# EAGLE design 2x2AND_OR_1 (EAGLE 6.5.0)

## Sheet 1 of 3
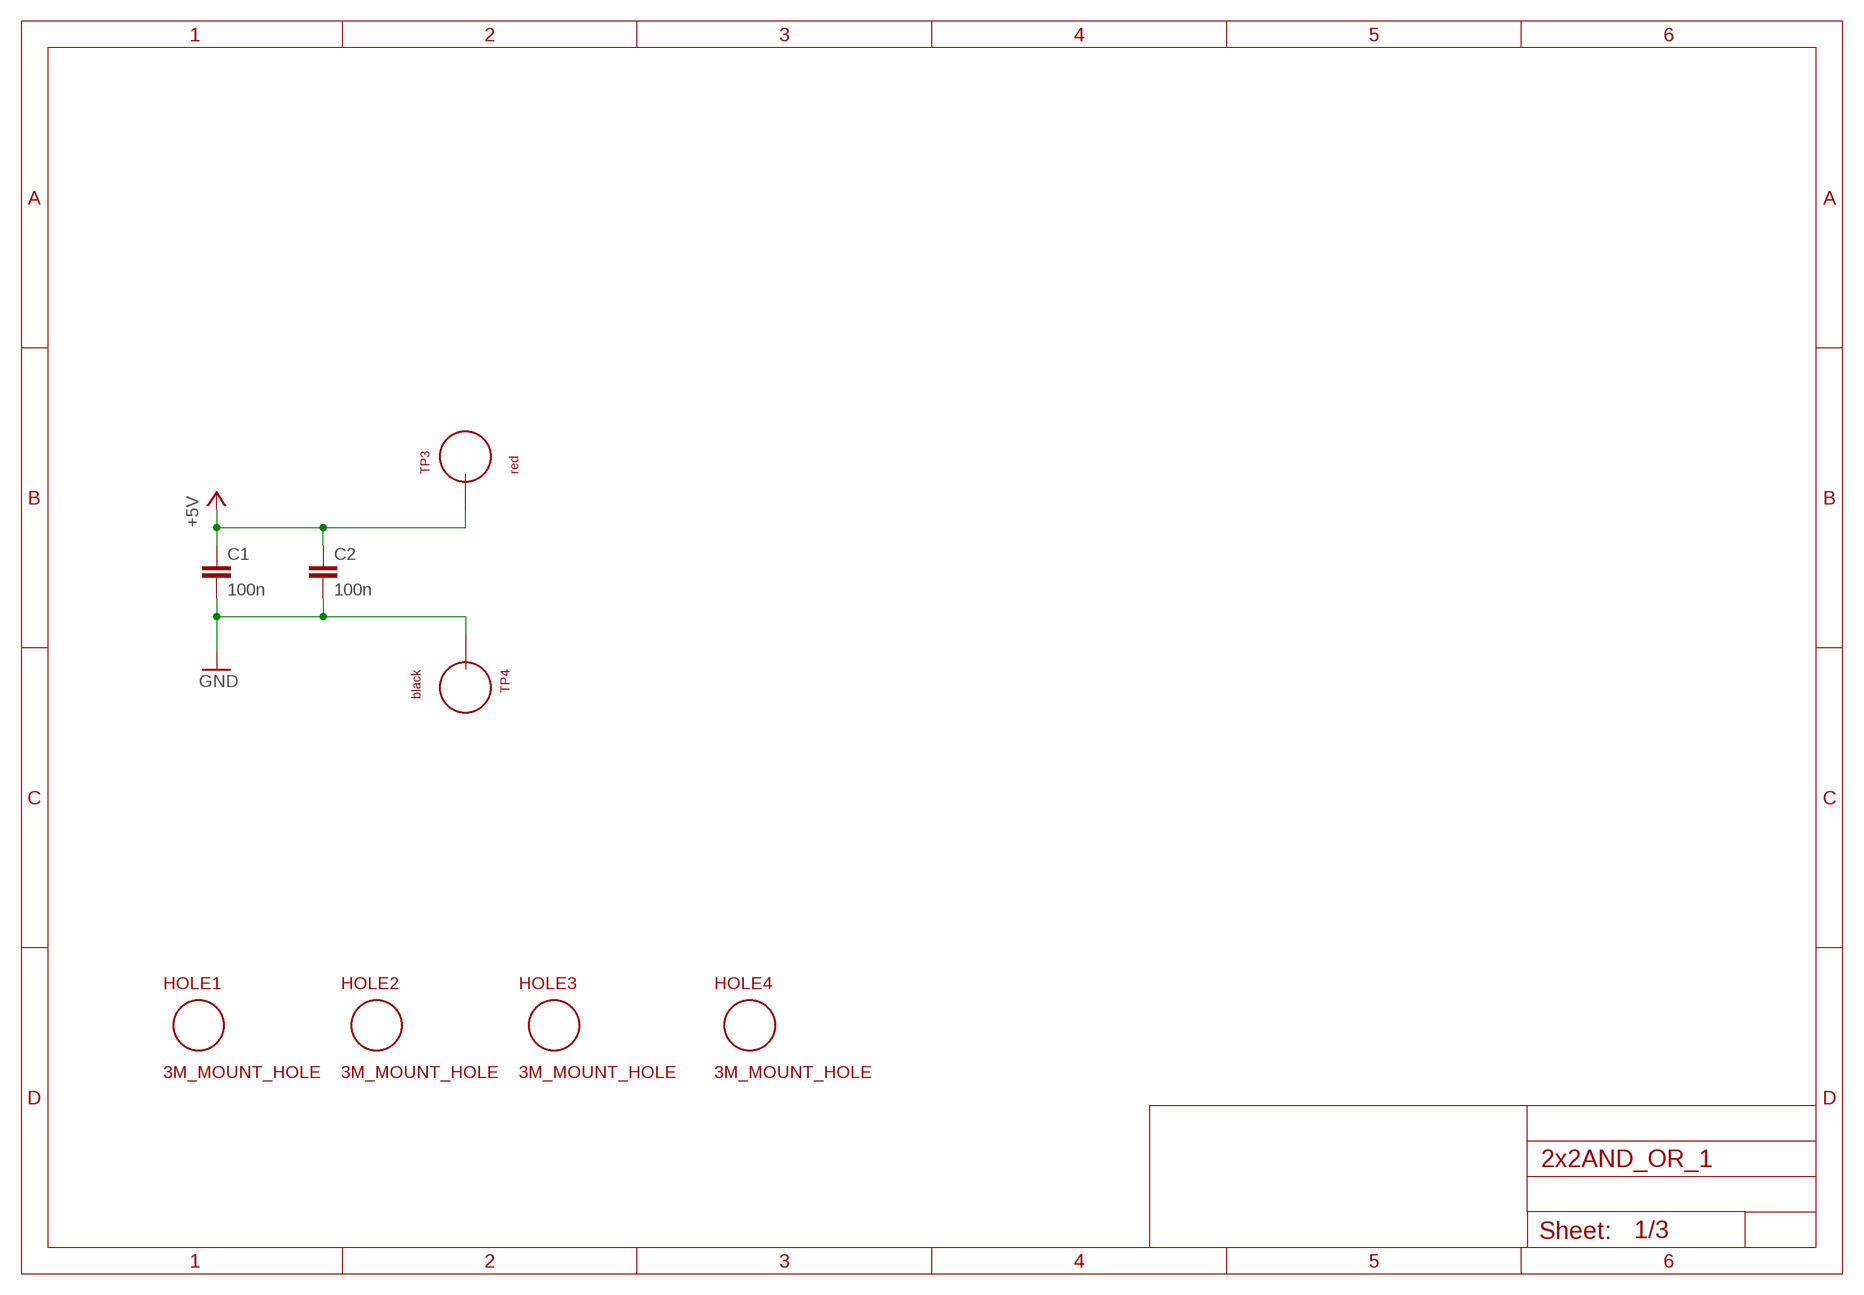
[diagram p0: schematic, sheet 1]

### Parts
C1  100n  C_P2INCH  [CAP_P2INCH]
C2  100n  C_P2INCH  [CAP_P2INCH]
HOLE1  3M_MOUNT_HOLE  [3M_HOLE]
HOLE2  3M_MOUNT_HOLE  [3M_HOLE]
HOLE3  3M_MOUNT_HOLE  [3M_HOLE]
HOLE4  3M_MOUNT_HOLE  [3M_HOLE]
TP3  red  TEST_LOOP  [TEST_LOOP]
TP4  black  TEST_LOOP  [TEST_LOOP]

### Nets
+5V: C1.1 C2.1 TP3.P$1 ; also sheet 2,3
GND: C1.2 C2.2 TP4.P$1 ; also sheet 2,3

## Sheet 2 of 3
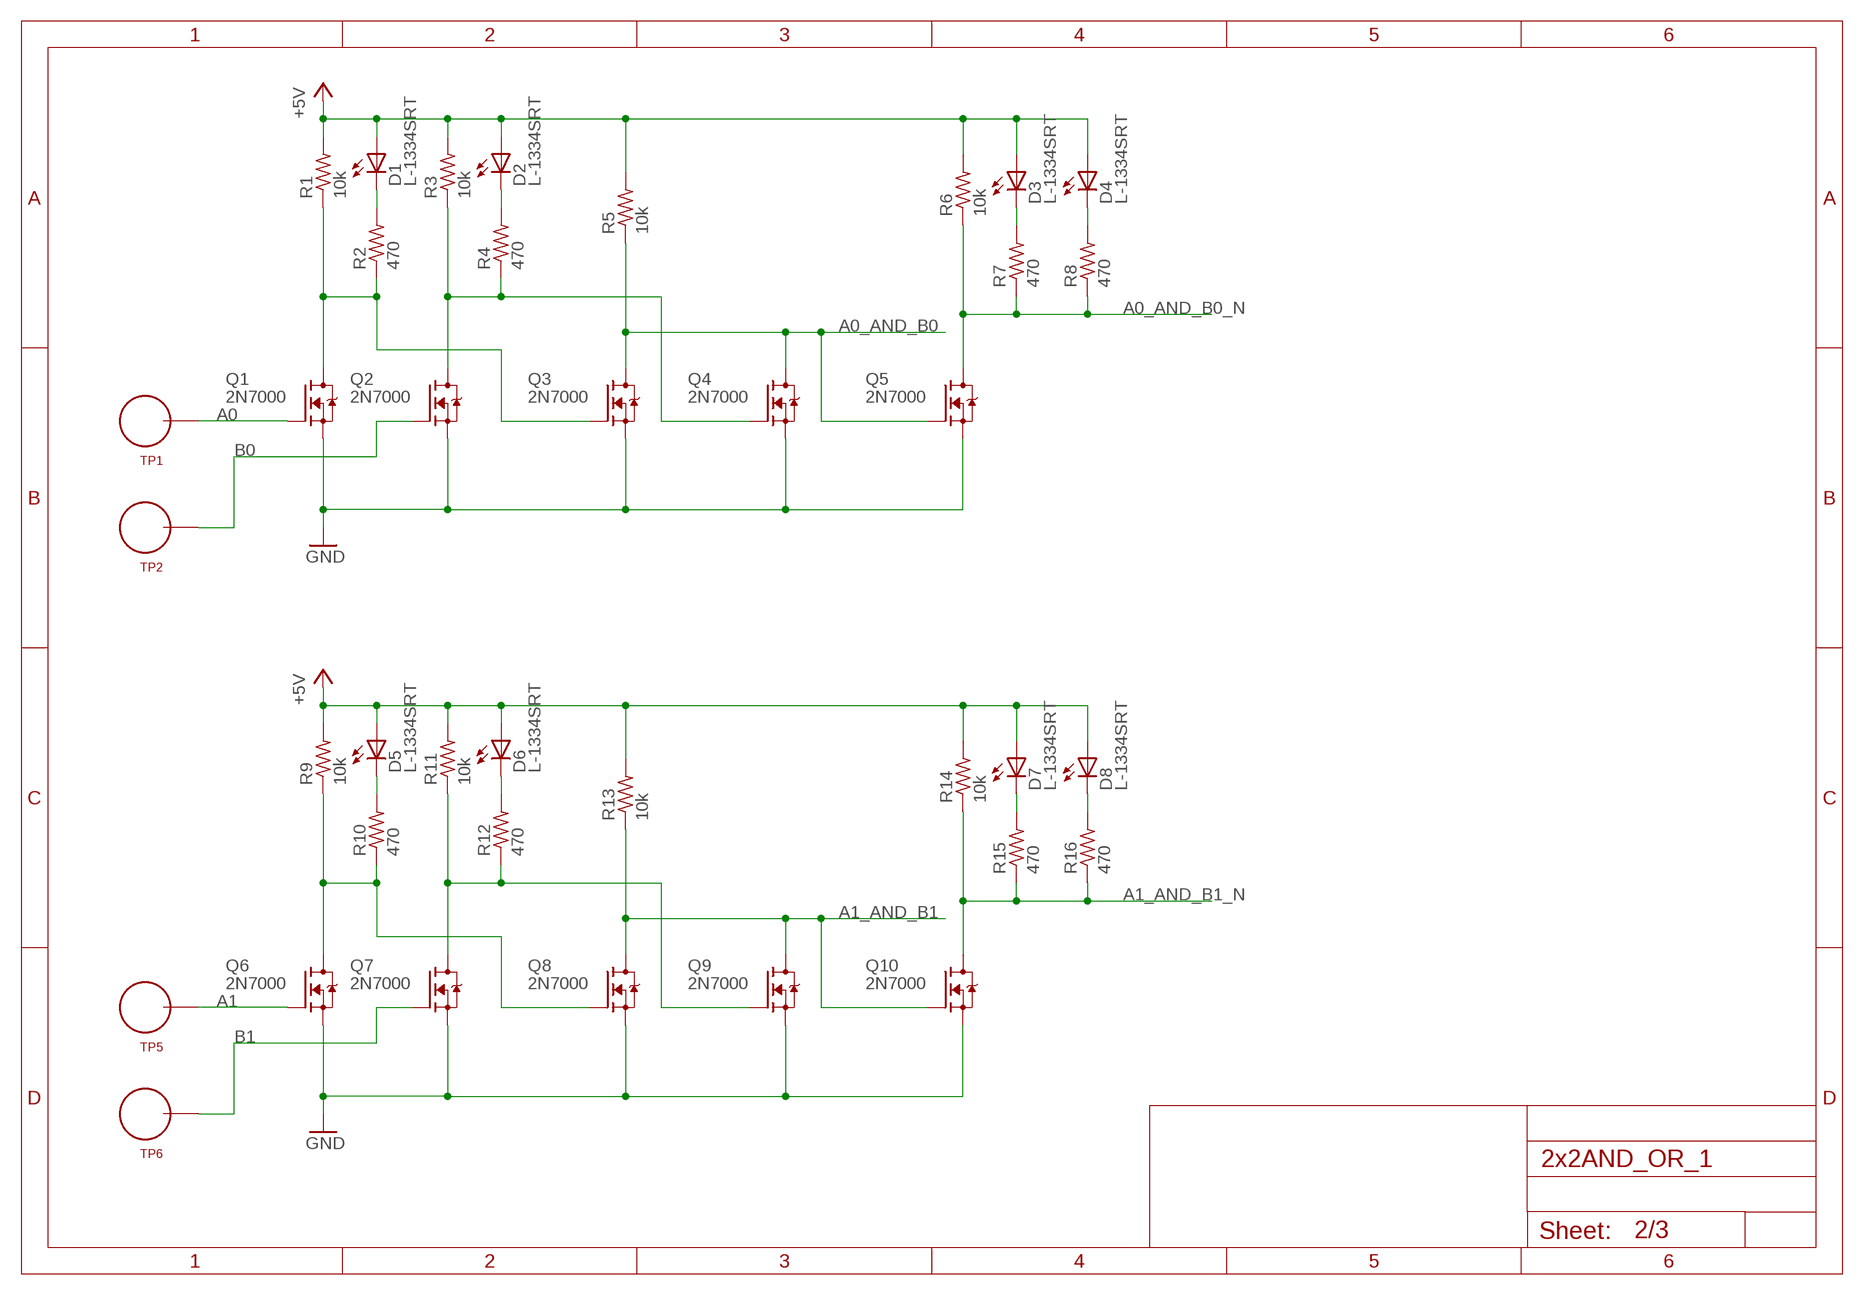
[diagram p1: schematic, sheet 2]

### Parts
D1  L-1334SRT  [LED3MM]
D2  L-1334SRT  [LED3MM]
D3  L-1334SRT  [LED3MM]
D4  L-1334SRT  [LED3MM]
D5  L-1334SRT  [LED3MM]
D6  L-1334SRT  [LED3MM]
D7  L-1334SRT  [LED3MM]
D8  L-1334SRT  [LED3MM]
Q1  2N7000  [TO92-DGS]
Q2  2N7000  [TO92-DGS]
Q3  2N7000  [TO92-DGS]
Q4  2N7000  [TO92-DGS]
Q5  2N7000  [TO92-DGS]
Q6  2N7000  [TO92-DGS]
Q7  2N7000  [TO92-DGS]
Q8  2N7000  [TO92-DGS]
Q9  2N7000  [TO92-DGS]
Q10  2N7000  [TO92-DGS]
R1  10k  R_P2INCH  [R_P2INCH]
R2  470  R_P2INCH  [R_P2INCH]
R3  10k  R_P2INCH  [R_P2INCH]
R4  470  R_P2INCH  [R_P2INCH]
R5  10k  R_P2INCH  [R_P2INCH]
R6  10k  R_P2INCH  [R_P2INCH]
R7  470  R_P2INCH  [R_P2INCH]
R8  470  R_P2INCH  [R_P2INCH]
R9  10k  R_P2INCH  [R_P2INCH]
R10  470  R_P2INCH  [R_P2INCH]
R11  10k  R_P2INCH  [R_P2INCH]
R12  470  R_P2INCH  [R_P2INCH]
R13  10k  R_P2INCH  [R_P2INCH]
R14  10k  R_P2INCH  [R_P2INCH]
R15  470  R_P2INCH  [R_P2INCH]
R16  470  R_P2INCH  [R_P2INCH]
TP1  TEST_LOOP  [TEST_LOOP]
TP2  TEST_LOOP  [TEST_LOOP]
TP5  TEST_LOOP  [TEST_LOOP]
TP6  TEST_LOOP  [TEST_LOOP]

### Nets
+5V: D1.A D2.A D3.A D4.A D5.A D6.A D7.A D8.A R1.2 R3.2 R5.2 R6.2 R9.2 R11.2 R13.2 R14.2 ; also sheet 1,3
A0: Q1.G TP1.P$1
A0_AND_B0: Q3.D Q4.D Q5.G R5.1 ; also sheet 3
A0_AND_B0_N: Q5.D R6.1 R7.1 R8.1
A1: Q6.G TP5.P$1
A1_AND_B1: Q8.D Q9.D Q10.G R13.1 ; also sheet 3
A1_AND_B1_N: Q10.D R14.1 R15.1 R16.1
B0: Q2.G TP2.P$1
B1: Q7.G TP6.P$1
GND: Q1.S Q2.S Q3.S Q4.S Q5.S Q6.S Q7.S Q8.S Q9.S Q10.S ; also sheet 1,3
N$1: D1.K(C) R2.2
N$2: Q1.D Q3.G R1.1 R2.1
N$3: D4.K(C) R8.2
N$4: D2.K(C) R4.2
N$5: Q2.D Q4.G R3.1 R4.1
N$6: D5.K(C) R10.2
N$7: Q6.D Q8.G R9.1 R10.1
N$8: D6.K(C) R12.2
N$9: D3.K(C) R7.2
N$10: Q7.D Q9.G R11.1 R12.1
N$11: D7.K(C) R15.2
N$12: D8.K(C) R16.2

## Sheet 3 of 3
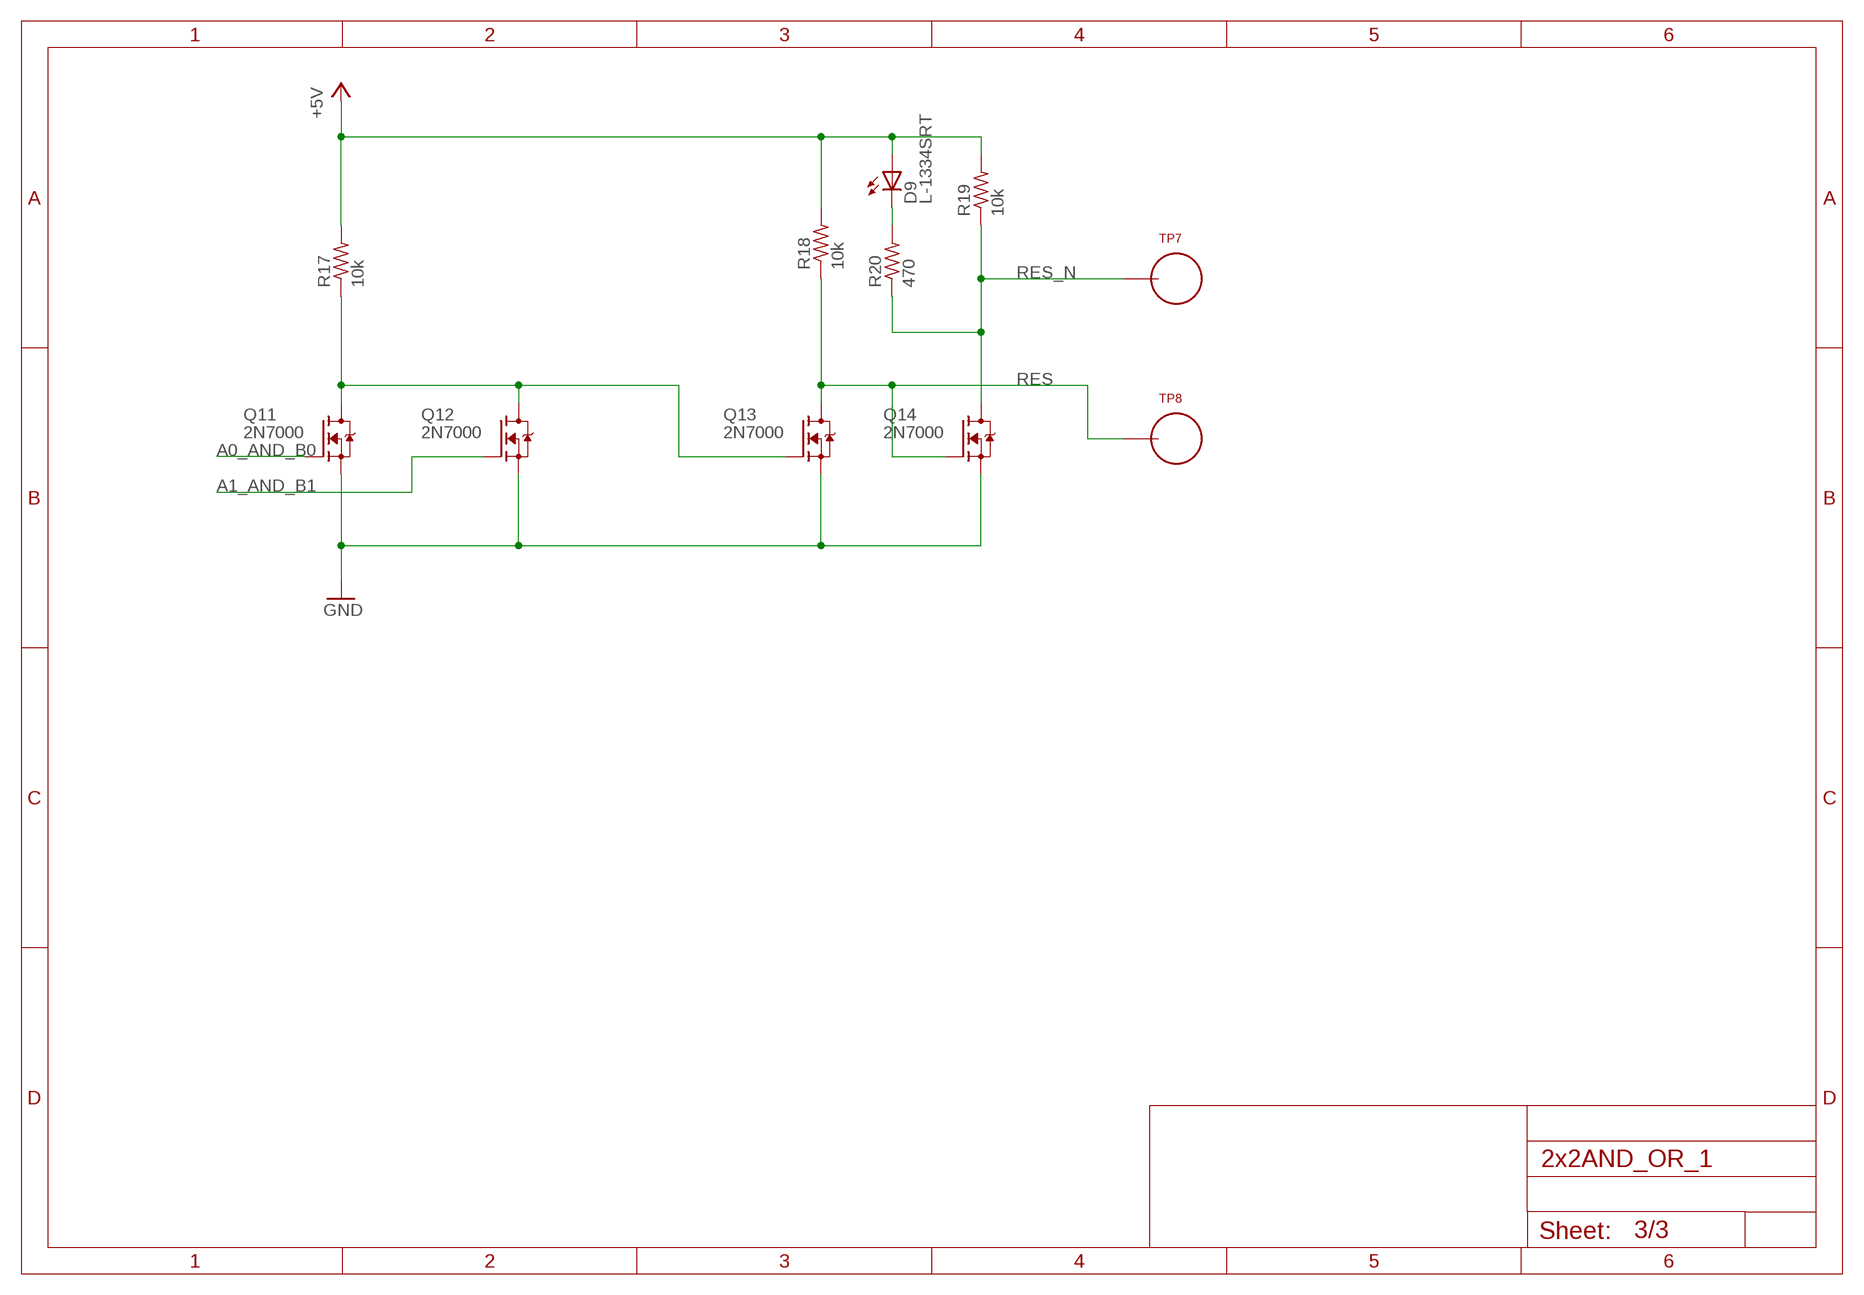
[diagram p2: schematic, sheet 3]

### Parts
D9  L-1334SRT  [LED3MM]
Q11  2N7000  [TO92-DGS]
Q12  2N7000  [TO92-DGS]
Q13  2N7000  [TO92-DGS]
Q14  2N7000  [TO92-DGS]
R17  10k  R_P2INCH  [R_P2INCH]
R18  10k  R_P2INCH  [R_P2INCH]
R19  10k  R_P2INCH  [R_P2INCH]
R20  470  R_P2INCH  [R_P2INCH]
TP7  TEST_LOOP  [TEST_LOOP]
TP8  TEST_LOOP  [TEST_LOOP]

### Nets
+5V: D9.A R17.2 R18.2 R19.2 ; also sheet 1,2
A0_AND_B0: Q11.G ; also sheet 2
A1_AND_B1: Q12.G ; also sheet 2
GND: Q11.S Q12.S Q13.S Q14.S ; also sheet 1,2
N$13: Q11.D Q12.D Q13.G R17.1
N$19: D9.K(C) R20.2
RES: Q13.D Q14.G R18.1 TP8.P$1
RES_N: Q14.D R19.1 R20.1 TP7.P$1

## Library data of the parts
C1 C2 = MyLib:C_P2INCH
D1-D9 = MyLib:L-1334SRT
HOLE1-HOLE4 = MyLib:3M_MOUNT_HOLE
Q1-Q14 = MyLib:2N7000
R1-R20 = MyLib:R_P2INCH
TP1-TP8 = MyLib:TEST_LOOP

## Board
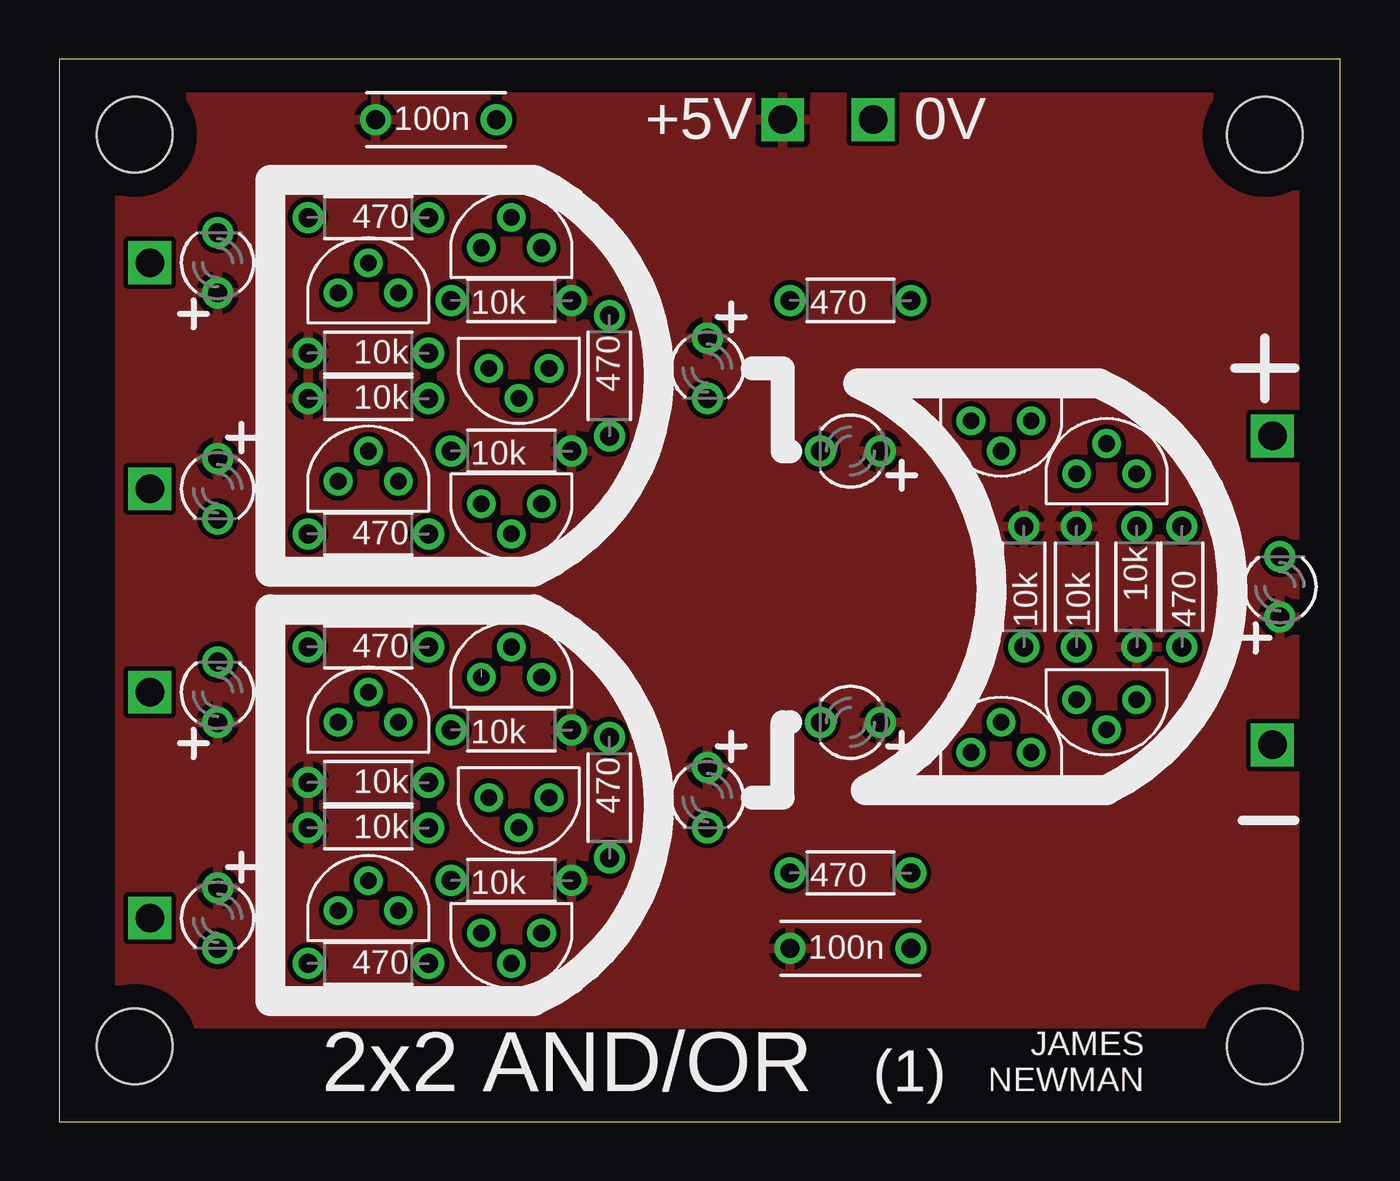
[diagram p3: board, top side]
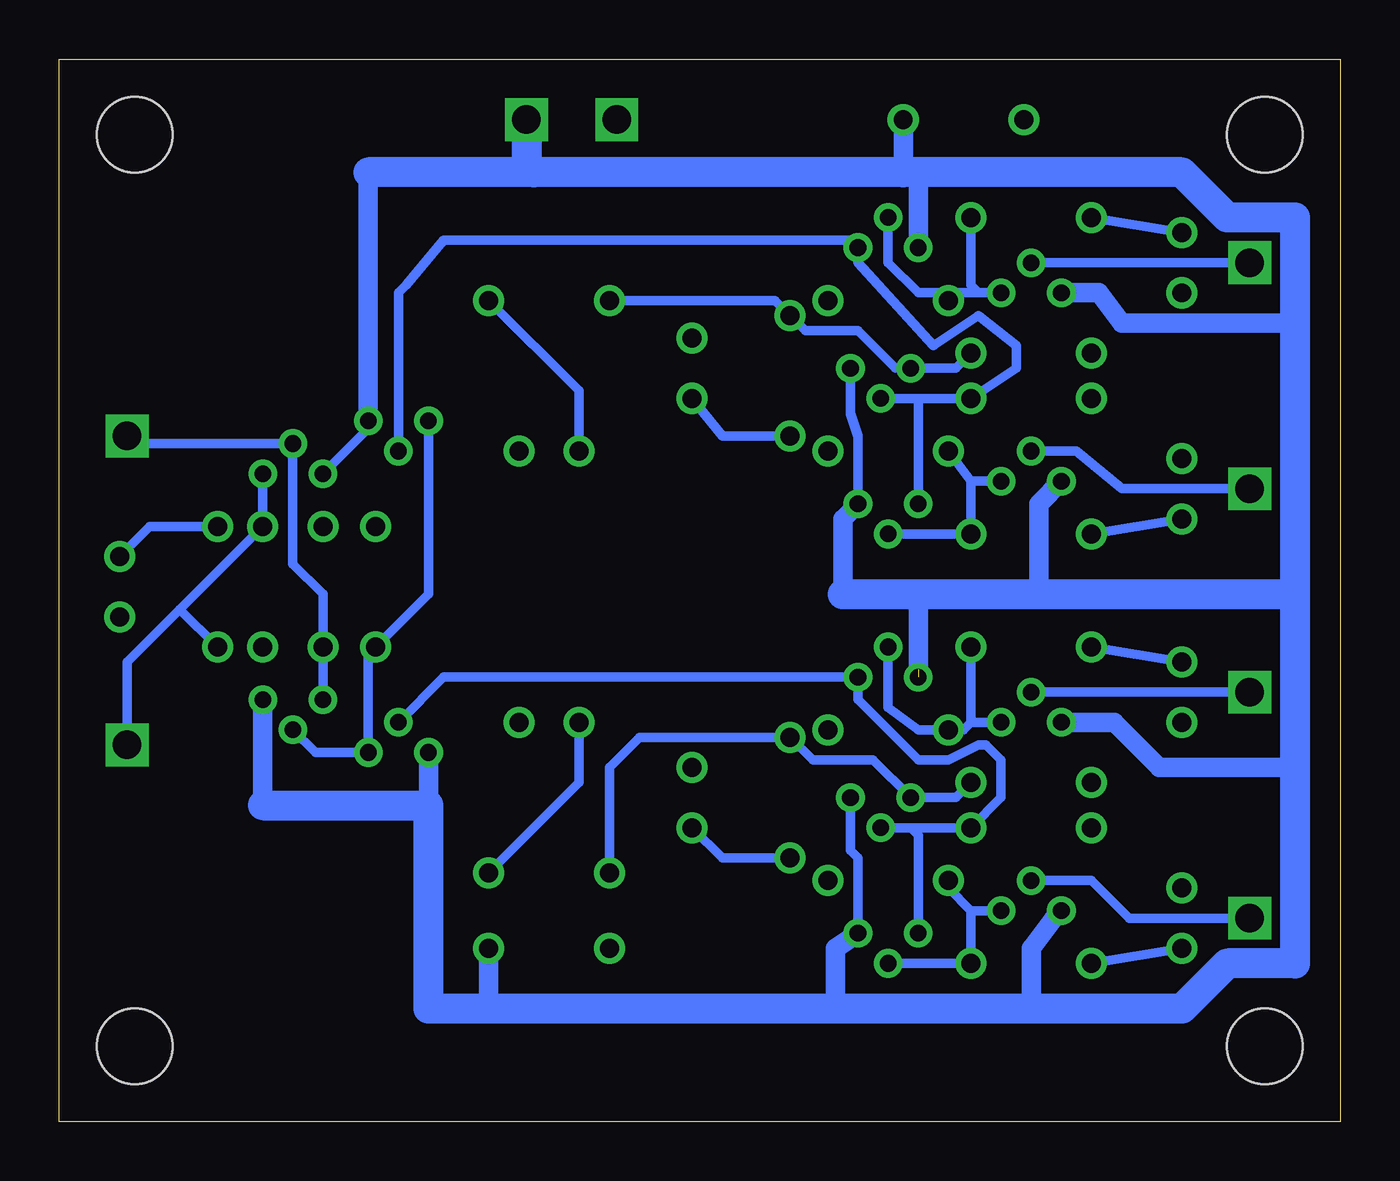
[diagram p4: board, bottom side, seen from below]

Size 53.98 x 44.77 mm. Coordinates in mm from the lower left corner, seen from the top.
Outline: 0,0 53.98,0 53.98,44.77 0,44.77 0,0
Copper layers (1*16): Top 0.035mm / dielectric 1.5mm / Bottom 0.035mm
Design rules "default": minimum track width 10mil, minimum drill 24mil, track to track 8mil, track to pad 8mil, pad to pad 8mil, via to via 8mil, smd to smd 8mil, copper to edge 40mil, drill to drill 8mil, minimum pad ring 10mil, minimum via ring 8mil, stop-mask expansion 4mil, vias tented up to drill 0mil, thermal gap 10mil

### Footprints (pad centres in the part's own frame; a part is rotated, then mirrored left to right if it is on the bottom)
CAP_P2INCH = drill 0.8: 1 -2.54,0; 2 2.54,0
LED3MM = drill 0.8: A -1.27,0; K 1.27,0
3M_HOLE = hole 3.2: 0,0
TO92-DGS = drill 0.7: D 0,1.27; G -1.27,0; S 0,-1.27
R_P2INCH = drill 0.8: 1 -2.54,0; 2 2.54,0
TEST_LOOP = drill 1.2 square: P$1 0,0

### Placement (x,y rotation side)
C1  15.88,42.23 0 top
C2  33.34,7.3 0 top
D1  6.67,36.2 90 top
D2  6.67,26.67 270 top
D3  27.3,31.75 270 top
D4  33.34,28.26 180 top
D5  6.67,18.1 90 top
D6  6.67,8.57 270 top
D7  27.3,13.65 270 top
D8  33.34,16.83 180 top
D9  51.44,22.54 90 top
HOLE1  3.17,3.17 0 top
HOLE2  50.8,3.17 0 top
HOLE3  3.17,41.59 0 top
HOLE4  50.8,41.59 0 top
Q1  13.02,34.92 270 top
Q2  13.02,26.99 270 top
Q3  19.05,36.83 270 top
Q4  19.05,26.04 90 top
Q5  19.37,31.75 90 top
Q6  13.02,16.83 270 top
Q7  13.02,8.89 270 top
Q8  19.05,18.73 270 top
Q9  19.05,7.94 90 top
Q10  19.37,13.65 90 top
Q11  39.69,29.53 90 top
Q12  39.69,15.56 270 top
Q13  44.13,17.78 90 top
Q14  44.13,27.3 270 top
R1  19.05,34.61 0 top
R2  13.02,38.1 180 top
R3  19.05,28.26 0 top
R4  13.02,24.77 180 top
R5  13.02,30.48 180 top
R6  13.02,32.38 180 top
R7  23.18,31.43 270 top
R8  33.34,34.61 0 top
R9  19.05,16.51 0 top
R10  13.02,20 180 top
R11  19.05,10.16 0 top
R12  13.02,6.67 180 top
R13  13.02,12.38 180 top
R14  13.02,14.29 180 top
R15  23.18,13.65 270 top
R16  33.34,10.48 0 top
R17  40.64,22.54 90 top
R18  42.86,22.54 90 top
R19  45.4,22.54 270 top
R20  47.31,22.54 90 top
TP1  3.81,36.2 0 top
TP2  3.81,26.67 0 top
TP3  30.48,42.23 0 top
TP4  34.29,42.23 0 top
TP5  3.81,18.1 0 top
TP6  3.81,8.57 0 top
TP7  51.12,15.88 0 top
TP8  51.12,28.89 0 top

### Tracks (layer width: path | path; a pad name or v marks a point on that pad's centre or on a via)
+5V
  pour Top: 2.54,43.18 2.54,4.13 52.07,4.13 52.07,43.18
A0
  Bottom 0.406: TP1.P$1 Q1.G
A0_AND_B0
  Bottom 0.406: Q4.D 17.78,30.48 | 17.78,30.48 Q5.G | 17.78,30.48 R5.1 13.65,31.75 13.65,32.7 15.24,33.97 17.14,32.7 20.32,36.2 Q3.D 20.64,37.15 37.78,37.15 39.37,35.24 39.69,34.92 Q11.G
A0_AND_B0_N
  Bottom 0.406: R6.1 16.19,31.75 Q5.D 18.73,31.75 20.32,33.34 22.54,33.34 R7.1 23.81,34.61 R8.1
A1
  Bottom 0.406: TP5.P$1 Q6.G
A1_AND_B1
  Bottom 0.406: 18.1,12.38 R13.1 14.29,13.65 14.29,15.24 14.92,15.88 15.24,15.88 16.51,15.24 17.78,15.24 20.32,17.78 Q8.D 37.78,18.73 Q12.G | 18.1,12.38 Q10.G | Q9.D 17.78,12.06 18.1,12.38
A1_AND_B1_N
  Bottom 0.406: R14.1 16.19,13.65 Q10.D 19.68,15.24 22.23,15.24 R15.1 29.53,16.19 30.8,14.92 R16.1
B0
  Bottom 0.406: Q2.G 11.11,28.26 9.21,26.67 TP2.P$1
B1
  Bottom 0.406: TP6.P$1 8.89,8.57 10.48,10.16 Q7.G
GND  (1 unrouted)
  Bottom 0.406: Q4.S 20.32,28.89 20.64,29.84 Q5.S | Q10.S 20.64,11.43 20.32,11.11 Q9.S | Q11.S 40.96,29.21 Q14.S
  Bottom 0.813: 40.96,40.01 Q11.S | Q9.S 21.27,7.3 21.27,4.76 | Q7.S 12.06,8.57 13.02,7.3 13.02,4.76 | Q6.S 9.53,16.83 7.62,14.92 1.91,14.92 | Q1.S 10.16,34.92 9.21,33.66 1.91,33.66 | Q2.S 12.7,26.04 12.7,22.54 12.38,22.23 | Q4.S 20.95,25.4 20.95,22.23 | Q3.S 17.78,39.69 17.46,40.01 | Q13.S 45.4,13.34 | Q12.S 38.42,13.34 | C1.2 18.41,40.01 | 17.78,19.05 17.78,22.23 | C2.2 35.88,5.08 36.2,4.76
  Bottom 1.27: 1.91,22.23 1.91,33.66 1.91,38.1 4.76,38.1 6.67,40.01 17.46,40.01 18.41,40.01 33.97,40.01 | 20.95,22.23 17.78,22.23 12.38,22.23 1.91,22.23 | 33.97,40.01 40.96,40.01 | 1.91,22.23 1.91,14.92 1.91,6.67 4.76,6.67 6.67,4.76 13.02,4.76 21.27,4.76 36.2,4.76 38.42,4.76 38.42,13.34 45.4,13.34 | TP4.P$1 34.29,40.32 33.97,40.01
N$1
  Bottom 0.406: R2.2 D1.K
N$2
  Bottom 0.406: Q3.G 19.05,36.2 17.78,34.92 16.83,34.92 R1.1 16.19,34.92 15.24,34.92 | Q1.D 15.24,34.92 | R2.1 15.56,35.24 15.24,34.92
N$3
  Bottom 0.406: D4.K 32.07,30.8 R8.2
N$4
  Bottom 0.406: R4.2 D2.K
N$5
  Bottom 0.406: Q2.D 15.56,26.99 | 15.56,26.99 R3.1 | 15.56,26.99 R4.1 Q4.G
N$6
  Bottom 0.406: D5.K R10.2
N$7
  Bottom 0.406: R10.1 15.56,16.83 | 15.56,16.83 Q6.D | 15.56,16.83 15.88,16.51 R9.1 17.78,16.51 19.05,17.46 Q8.G
N$8
  Bottom 0.406: D6.K R12.2
N$9
  Bottom 0.406: R7.2 26.04,28.89 D3.K
N$10
  Bottom 0.406: Q9.G R12.1 15.56,8.89 | 15.56,8.89 Q7.D | R11.1 16.51,9.84 15.56,8.89
N$11
  Bottom 0.406: R15.2 26.04,11.11 D7.K
N$12
  Bottom 0.406: D8.K 32.07,14.29 R16.2
N$13
  Bottom 0.406: Q13.G 43.18,15.56 Q12.D 40.96,19.68 R17.1 38.42,22.23 Q11.D
N$19
  Bottom 0.406: R20.2 50.16,25.08 D9.K
RES
  Bottom 0.406: Q13.D R18.1 42.86,22.23 44.13,23.5 Q14.G 50.8,28.57 TP8.P$1
RES_N
  Bottom 0.406: Q14.D R19.1 48.9,21.59 | 48.9,21.59 51.12,19.37 TP7.P$1 | R20.1 48.9,21.59

### Text on the board
tPlace: +5V | 0V | 2x2 AND/OR | JAMES / NEWMAN | (1)